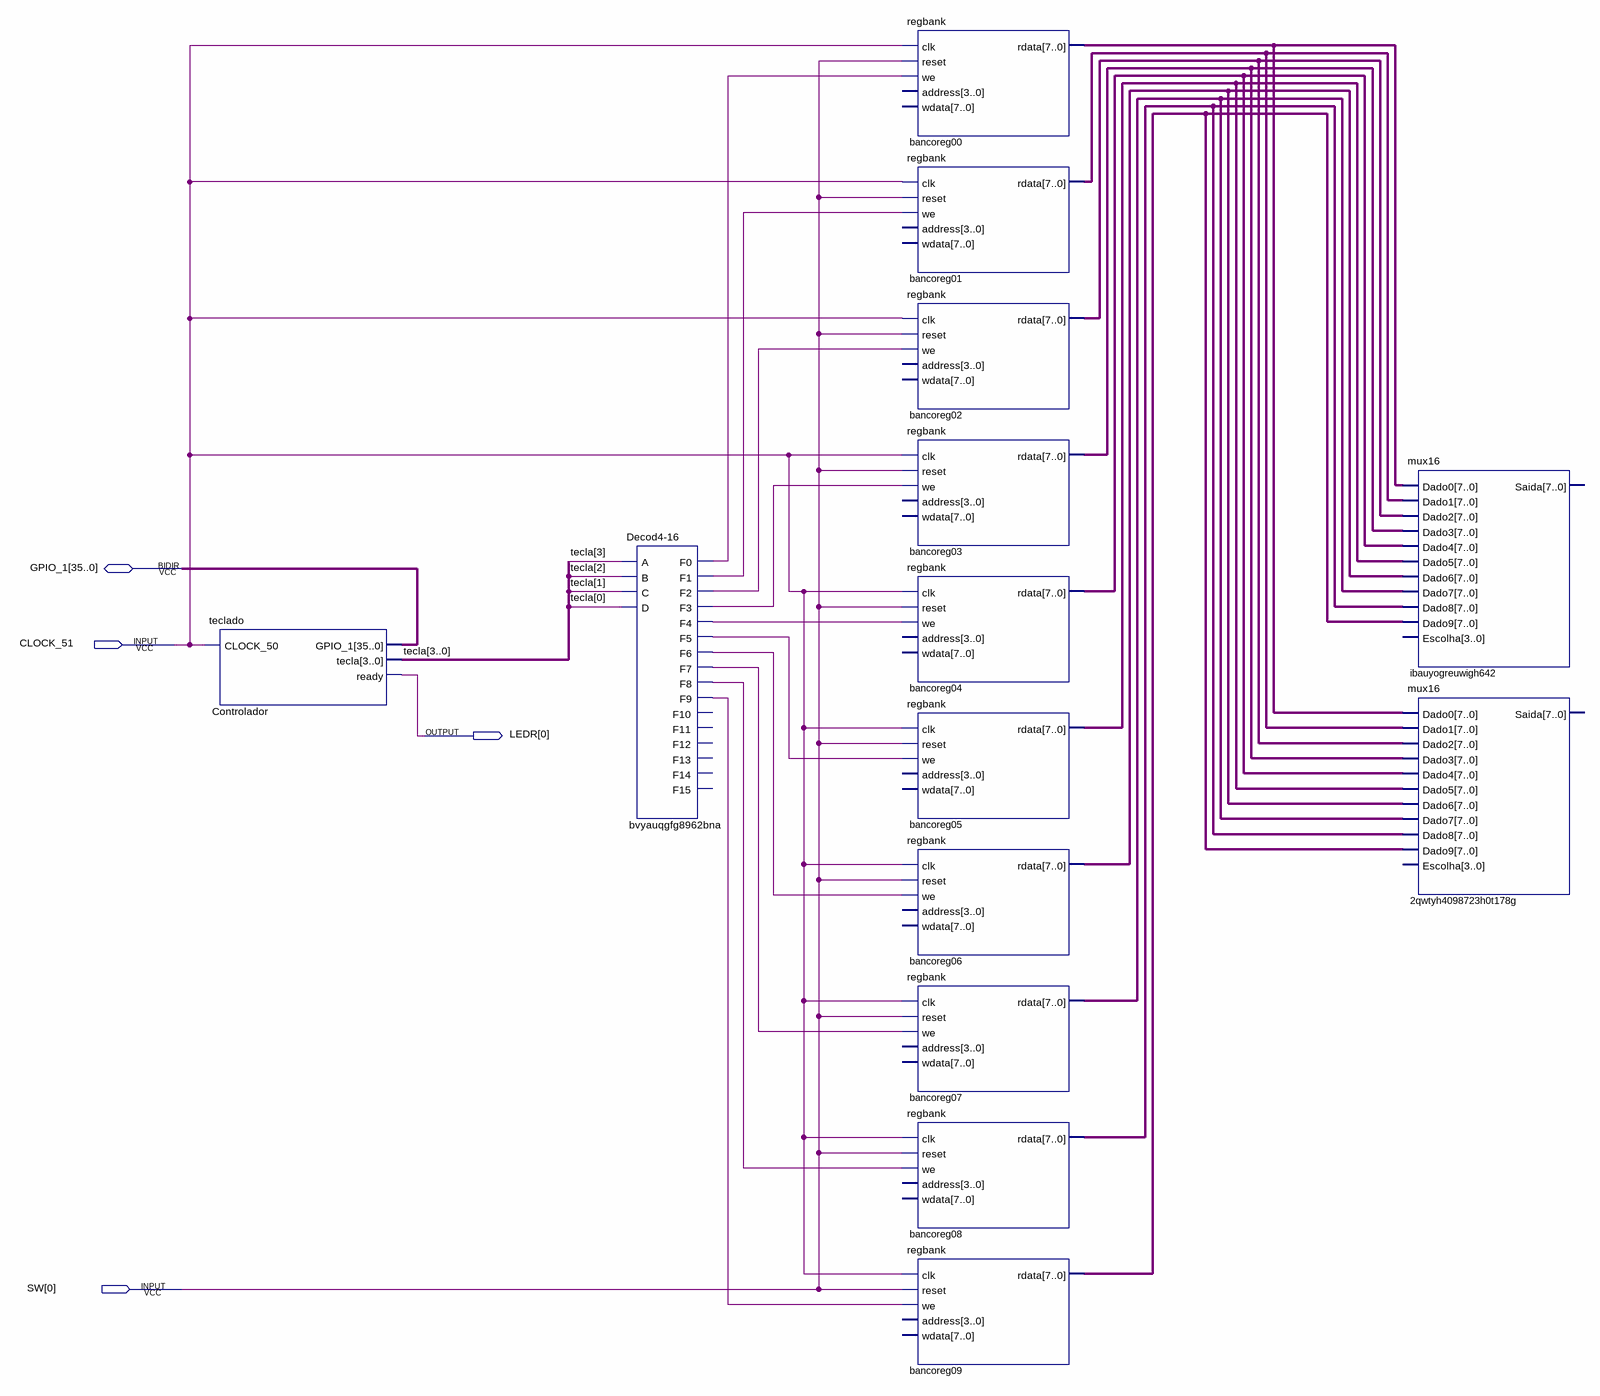
[diagram p0: schematic sheet]
// Quartus schematic Block1.bdf as structural Verilog: 14 symbols, 4 pins
module Block1 (
  input  CLOCK_51,
  input  [0:0] SW,
  inout  [35:0] GPIO_1,
  output [0:0] LEDR
);

  wire bvyauqgfg8962bna_f0, bvyauqgfg8962bna_f1, bvyauqgfg8962bna_f2, bvyauqgfg8962bna_f3,
       bvyauqgfg8962bna_f4, bvyauqgfg8962bna_f5, bvyauqgfg8962bna_f6, bvyauqgfg8962bna_f7,
       bvyauqgfg8962bna_f8, bvyauqgfg8962bna_f9;
  wire [3:0] tecla;
  wire [7:0] bancoreg00_rdata, bancoreg01_rdata, bancoreg02_rdata, bancoreg03_rdata, bancoreg04_rdata,
       bancoreg05_rdata, bancoreg06_rdata, bancoreg07_rdata, bancoreg08_rdata, bancoreg09_rdata;

  teclado Controlador (.CLOCK_50(CLOCK_51), .tecla(tecla), .ready(LEDR[0]), .GPIO_1(GPIO_1));
  \Decod4-16  bvyauqgfg8962bna (
    .A(tecla[3]), .B(tecla[2]), .C(tecla[1]), .D(tecla[0]), .F0(bvyauqgfg8962bna_f0),
    .F1(bvyauqgfg8962bna_f1), .F2(bvyauqgfg8962bna_f2), .F3(bvyauqgfg8962bna_f3), .F4(bvyauqgfg8962bna_f4),
    .F5(bvyauqgfg8962bna_f5), .F6(bvyauqgfg8962bna_f6), .F7(bvyauqgfg8962bna_f7), .F8(bvyauqgfg8962bna_f8),
    .F9(bvyauqgfg8962bna_f9));  // open: F10, F11, F12, F13, F14, F15
  regbank bancoreg00 (
    .clk(CLOCK_51), .reset(SW[0]), .we(bvyauqgfg8962bna_f0), .rdata(bancoreg00_rdata));  // open: address, wdata
  regbank bancoreg01 (
    .clk(CLOCK_51), .reset(SW[0]), .we(bvyauqgfg8962bna_f1), .rdata(bancoreg01_rdata));  // open: address, wdata
  regbank bancoreg02 (
    .clk(CLOCK_51), .reset(SW[0]), .we(bvyauqgfg8962bna_f2), .rdata(bancoreg02_rdata));  // open: address, wdata
  regbank bancoreg03 (
    .clk(CLOCK_51), .reset(SW[0]), .we(bvyauqgfg8962bna_f3), .rdata(bancoreg03_rdata));  // open: address, wdata
  regbank bancoreg04 (
    .clk(CLOCK_51), .reset(SW[0]), .we(bvyauqgfg8962bna_f4), .rdata(bancoreg04_rdata));  // open: address, wdata
  regbank bancoreg05 (
    .clk(CLOCK_51), .reset(SW[0]), .we(bvyauqgfg8962bna_f5), .rdata(bancoreg05_rdata));  // open: address, wdata
  regbank bancoreg06 (
    .clk(CLOCK_51), .reset(SW[0]), .we(bvyauqgfg8962bna_f6), .rdata(bancoreg06_rdata));  // open: address, wdata
  regbank bancoreg07 (
    .clk(CLOCK_51), .reset(SW[0]), .we(bvyauqgfg8962bna_f7), .rdata(bancoreg07_rdata));  // open: address, wdata
  regbank bancoreg08 (
    .clk(CLOCK_51), .reset(SW[0]), .we(bvyauqgfg8962bna_f8), .rdata(bancoreg08_rdata));  // open: address, wdata
  regbank bancoreg09 (
    .clk(CLOCK_51), .reset(SW[0]), .we(bvyauqgfg8962bna_f9), .rdata(bancoreg09_rdata));  // open: address, wdata
  mux16 ibauyogreuwigh642 (
    .Dado0(bancoreg00_rdata), .Dado1(bancoreg01_rdata), .Dado2(bancoreg02_rdata), .Dado3(bancoreg03_rdata),
    .Dado4(bancoreg04_rdata), .Dado5(bancoreg05_rdata), .Dado6(bancoreg06_rdata), .Dado7(bancoreg07_rdata),
    .Dado8(bancoreg08_rdata), .Dado9(bancoreg09_rdata));  // open: Escolha, Saida
  mux16 u_2qwtyh4098723h0t178g (
    .Dado0(bancoreg00_rdata), .Dado1(bancoreg01_rdata), .Dado2(bancoreg02_rdata), .Dado3(bancoreg03_rdata),
    .Dado4(bancoreg04_rdata), .Dado5(bancoreg05_rdata), .Dado6(bancoreg06_rdata), .Dado7(bancoreg07_rdata),
    .Dado8(bancoreg08_rdata), .Dado9(bancoreg09_rdata));  // open: Escolha, Saida
endmodule
